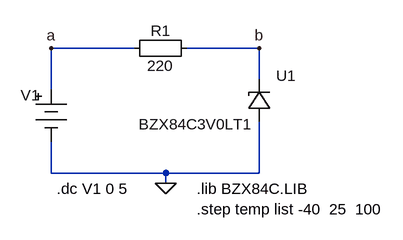
[diagram p0: schematic zener_va_3v.asc]
zener_va_3v.asc, the LTspice schematic file:
Version 4
SHEET 1 880 680
WIRE 96 -288 -32 -288
WIRE 288 -288 176 -288
WIRE 288 -240 288 -288
WIRE -32 -224 -32 -288
WIRE -32 -96 -32 -144
WIRE 144 -96 -32 -96
WIRE 288 -96 288 -176
WIRE 288 -96 144 -96
WIRE 144 -80 144 -96
FLAG 144 -80 0
FLAG 288 -288 b
FLAG -32 -288 a
SYMBOL Misc\\battery -32 -240 R0
WINDOW 123 0 0 Left 2
WINDOW 39 0 0 Left 2
WINDOW 0 -47 24 Left 2
WINDOW 3 -45 72 Left 2
SYMATTR InstName V1
SYMATTR Value ""
SYMBOL Misc\\EuropeanResistor 192 -304 R90
WINDOW 0 5 56 VBottom 2
WINDOW 3 27 56 VTop 2
SYMATTR InstName R1
SYMATTR Value 220
SYMBOL zener-macro-model 304 -176 R180
WINDOW 0 -41 70 Left 2
WINDOW 3 26 -5 Left 2
SYMATTR InstName U1
SYMATTR Value BZX84C3V0LT1
TEXT -24 -72 Left 2 !.dc V1 0 5
TEXT 192 -40 Left 2 !.step temp list -40  25  100
TEXT 192 -72 Left 2 !.lib BZX84C.LIB

The netlist it stands for:
* zener_va_3v.asc
V1 a 0
R1 b a 220
XU1 0 b BZX84C3V0LT1  ; pins + -
.dc V1 0 5
.step temp list -40  25  100
.lib BZX84C.LIB
.backanno
.end